# EAGLE design ssx32 (EAGLE 7.5.0)
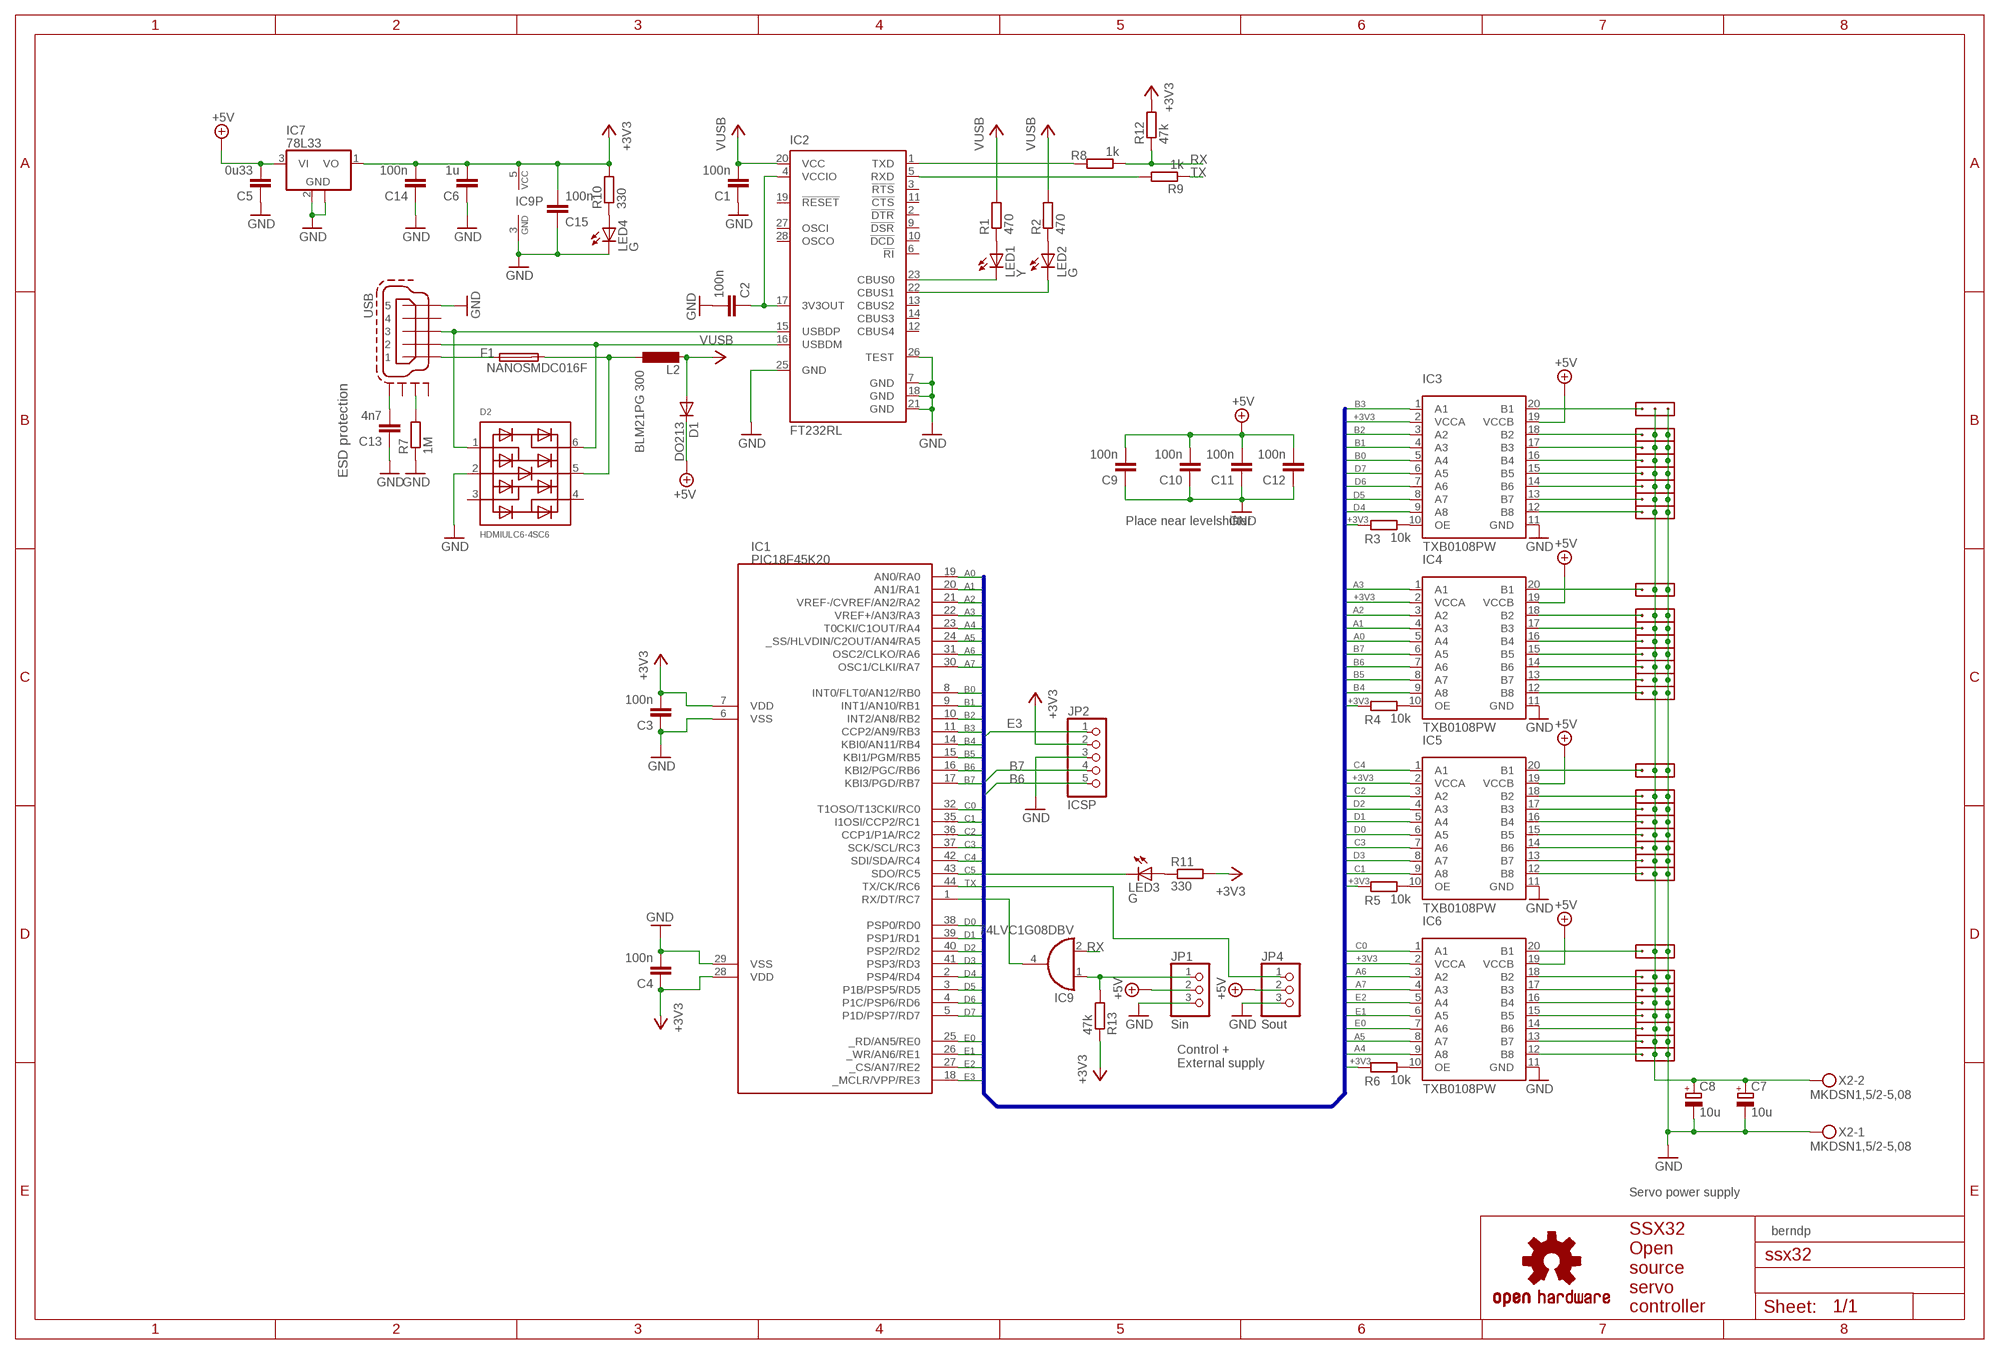
[diagram p0: schematic, sheet 1]

## Parts
C1  100n  C-EUC0603  [C0603]
C2  100n  C-EUC0603  [C0603]
C3  100n  C-EUC0603  [C0603]
C4  100n  C-EUC0603  [C0603]
C5  0u33  C-EUC0805  [C0805]
C6  1u  C-EUC0603  [C0603]
C7  10u  CPOL-EU153CLV-0505  [153CLV-0505]
C8  10u  CPOL-EU153CLV-0505  [153CLV-0505]
C9  100n  C-EUC0603  [C0603]
C10  100n  C-EUC0603  [C0603]
C11  100n  C-EUC0603  [C0603]
C12  100n  C-EUC0603  [C0603]
C13  4n7  C-EUC0603  [C0603]
C14  100n  C-EUC0603  [C0603]
C15  100n  C-EUC0603  [C0603]
D1  DO213  DIODE-MINIMELF  [MINIMELF]
D2  HDMIULC6-4SC6  [SOT23-5]
F1  NANOSMDC016F  [NANOSMDC016F]
IC1  PIC18F45K20  PIC18FXX20_PIC18LF4520-E/PT  [PIC18FXX20_TQFP44]
IC2  FT232RL  [SSOP28]
IC3  TXB0108PW  [PW_R-PDSO-G20]
IC4  TXB0108PW  [PW_R-PDSO-G20]
IC5  TXB0108PW  [PW_R-PDSO-G20]
IC6  TXB0108PW  [PW_R-PDSO-G20]
IC7  78L33  78L05F  [SOT89]
IC9  74LVC1G08DBV  [SOT23-5]
JP1  Sin  PINHD-1X3  [1X03]
JP2  ICSP  PINHD-1X5  [1X05]
JP4  Sout  PINHD-1X3  [1X03]
L2  BLM21PG 300  L-EU0805  [R0805]
LED1  Y  LEDCHIPLED_0603  [CHIPLED_0603]
LED2  G  LEDCHIPLED_0603  [CHIPLED_0603]
LED3  G  LEDCHIPLED_0603  [CHIPLED_0603]
LED4  G  LEDCHIPLED_0603  [CHIPLED_0603]
R1  470  R-EU_R0603  [R0603]
R2  470  R-EU_R0603  [R0603]
R3  10k  R-EU_R0603  [R0603]
R4  10k  R-EU_R0603  [R0603]
R5  10k  R-EU_R0603  [R0603]
R6  10k  R-EU_R0603  [R0603]
R7  1M  R-EU_R0603  [R0603]
R8  1k  R-EU_R0603  [R0603]
R9  1k  R-EU_R0603  [R0603]
R10  330  R-EU_R0603  [R0603]
R11  330  R-EU_R0603  [R0603]
R12  47k  R-EU_R0603  [R0603]
R13  47k  R-EU_R0603  [R0603]
U$2  OSHW-LOGOM  [OSHW-LOGO-M]
X1  8  PIN-1X3SM  [1X3]
X2  MKDSN1,5/2-5,08  [MKDSN1,5/2-5,08]
X3  17  PIN-1X3SM  [1X3]
X4  7  PIN-1X3SM  [1X3]
X5  6  PIN-1X3SM  [1X3]
X6  5  PIN-1X3SM  [1X3]
X7  4  PIN-1X3SM  [1X3]
X8  3  PIN-1X3SM  [1X3]
X9  2  PIN-1X3SM  [1X3]
X10  1  PIN-1X3SM  [1X3]
X11  19  PIN-1X3SM  [1X3]
X12  16  PIN-1X3SM  [1X3]
X13  15  PIN-1X3SM  [1X3]
X14  14  PIN-1X3SM  [1X3]
X15  13  PIN-1X3SM  [1X3]
X16  12  PIN-1X3SM  [1X3]
X17  11  PIN-1X3SM  [1X3]
X18  10  PIN-1X3SM  [1X3]
X19  9  PIN-1X3SM  [1X3]
X20  20  PIN-1X3SM  [1X3]
X21  21  PIN-1X3SM  [1X3]
X22  22  PIN-1X3SM  [1X3]
X23  23  PIN-1X3SM  [1X3]
X24  24  PIN-1X3SM  [1X3]
X25  25  PIN-1X3SM  [1X3]
X26  26  PIN-1X3SM  [1X3]
X27  27  PIN-1X3SM  [1X3]
X28  28  PIN-1X3SM  [1X3]
X29  29  PIN-1X3SM  [1X3]
X30  30  PIN-1X3SM  [1X3]
X31  31  PIN-1X3SM  [1X3]
X32  32  PIN-1X3SM  [1X3]
X34  18  PIN-1X3SM  [1X3]
X35  USB  MINI-USB-SCHIELD-32005-301  [32005-301]

## Nets
+3V3: C3.2 C4.1 C6.2 C14.2 C15.2 IC1.7(VDD) IC1.28(VDD) IC3.2(VCCA) IC4.2(VCCA) IC5.2(VCCA) IC6.2(VCCA) IC7.1(VO) IC9.5(VCC) JP2.2 R3.1 R4.1 R5.1 R6.1 R10.2 R11.2 R12.2 R13.1
+5V: C1.2 D1.A IC2.20(VCC) L2.2 R1.2 R2.2 ; supply symbol labelled VUSB
+UB: C5.2 C9.2 C10.2 C11.2 C12.2 D1.C IC3.19(VCCB) IC4.19(VCCB) IC5.19(VCCB) IC6.19(VCCB) IC7.3(VI) JP1.2 JP4.2 ; supply symbol labelled +5V
A0: IC1.19(AN0/RA0) IC4.5(A4)
A1: IC1.20(AN1/RA1) IC4.4(A3)
A2: IC1.21(VREF-/CVREF/AN2/RA2) IC4.3(A2)
A3: IC1.22(VREF+/AN3/RA3) IC4.1(A1)
A4: IC1.23(T0CKI/C1OUT/RA4) IC6.9(A8)
A5: IC1.24(_SS/HLVDIN/C2OUT/AN4/RA5) IC6.8(A7)
A6: IC1.31(OSC2/CLKO/RA6) IC6.3(A2)
A7: IC1.30(OSC1/CLKI/RA7) IC6.4(A3)
B0: IC1.8(INT0/FLT0/AN12/RB0) IC3.5(A4)
B1: IC1.9(INT1/AN10/RB1) IC3.4(A3)
B2: IC1.10(INT2/AN8/RB2) IC3.3(A2)
B3: IC1.11(CCP2/AN9/RB3) IC3.1(A1)
B4: IC1.14(KBI0/AN11/RB4) IC4.9(A8)
B5: IC1.15(KBI1/PGM/RB5) IC4.8(A7)
B6: IC1.16(KBI2/PGC/RB6) IC4.7(A6) JP2.5
B7: IC1.17(KBI3/PGD/RB7) IC4.6(A5) JP2.4
C0: IC1.32(T1OSO/T13CKI/RC0) IC6.1(A1)
C1: IC1.35(I1OSI/CCP2/RC1) IC5.9(A8)
C2: IC1.36(CCP1/P1A/RC2) IC5.8(A7)
C3: IC1.37(SCK/SCL/RC3) IC5.7(A6)
C4: IC1.42(SDI/SDA/RC4) IC5.1(A1)
C5: IC1.43(SDO/RC5) LED3.C
D0: IC1.38(PSP0/RD0) IC5.6(A5)
D1: IC1.39(PSP1/RD1) IC5.5(A4)
D2: IC1.40(PSP2/RD2) IC5.4(A3)
D3: IC1.41(PSP3/RD3) IC5.3(A2)
D4: IC1.2(PSP4/RD4) IC3.9(A8)
D5: IC1.3(P1B/PSP5/RD5) IC3.8(A7)
D6: IC1.4(P1C/PSP6/RD6) IC3.7(A6)
D7: IC1.5(P1D/PSP7/RD7) IC3.6(A5)
E0: IC1.25(_RD/AN5/RE0) IC6.7(A6)
E1: IC1.26(_WR/AN6/RE1) IC6.6(A5)
E2: IC1.27(_CS/AN7/RE2) IC6.5(A4)
E3: IC1.18(_MCLR/VPP/RE3) JP2.1
GND: C1.1 C2.2 C3.1 C4.2 C5.1 C6.1 C7.- C8.- C9.1 C10.1 C11.1 C12.1 C13.1 C14.1 C15.1 D2.2 IC1.6(VSS) IC1.29(VSS) IC2.7(GND) IC2.18(GND) IC2.21(GND) IC2.25(GND) IC2.26(TEST) IC3.11(GND) IC4.11(GND) IC5.11(GND) IC6.11(GND) IC7.2(GND) IC7.2@1(GND) IC9.3(GND) JP1.3 JP2.3 JP4.3 LED4.C R7.1 X1.P$3 X2.1 X3.P$3 X4.P$3 X5.P$3 X6.P$3 X7.P$3 X8.P$3 X9.P$3 X10.P$3 X11.P$3 X12.P$3 X13.P$3 X14.P$3 X15.P$3 X16.P$3 X17.P$3 X18.P$3 X19.P$3 X20.P$3 X21.P$3 X22.P$3 X23.P$3 X24.P$3 X25.P$3 X26.P$3 X27.P$3 X28.P$3 X29.P$3 X30.P$3 X31.P$3 X32.P$3 X34.P$3 X35.5
N$1: D2.6 IC2.16(USBDM) X35.2
N$2: F1.1 X35.1
N$3: IC2.23(CBUS0) LED1.C
N$4: IC2.22(CBUS1) LED2.C
N$5: LED1.A R1.1
N$6: LED2.A R2.1
N$8: IC3.20(B1) X1.P$1
N$9: IC3.10(OE) R3.2
N$10: IC4.10(OE) R4.2
N$11: IC5.10(OE) R5.2
N$12: IC6.10(OE) R6.2
N$13: IC4.18(B2) X13.P$1
N$14: IC3.18(B2) X4.P$1
N$15: IC3.17(B3) X5.P$1
N$16: IC3.16(B4) X6.P$1
N$17: IC3.15(B5) X7.P$1
N$18: IC3.14(B6) X8.P$1
N$19: IC3.13(B7) X9.P$1
N$20: IC3.12(B8) X10.P$1
N$21: IC5.17(B3) X11.P$1
N$22: IC4.17(B3) X14.P$1
N$23: IC4.16(B4) X15.P$1
N$24: IC4.15(B5) X16.P$1
N$25: IC4.14(B6) X17.P$1
N$26: IC4.13(B7) X18.P$1
N$27: IC4.12(B8) X19.P$1
N$28: IC5.16(B4) X20.P$1
N$29: IC5.15(B5) X21.P$1
N$30: IC5.14(B6) X22.P$1
N$31: IC5.13(B7) X23.P$1
N$32: IC5.12(B8) X24.P$1
N$33: IC5.20(B1) X3.P$1
N$34: IC4.20(B1) X12.P$1
N$35: IC6.16(B4) X28.P$1
N$36: IC6.15(B5) X29.P$1
N$37: IC6.14(B6) X30.P$1
N$38: IC6.13(B7) X31.P$1
N$39: IC6.12(B8) X32.P$1
N$40: IC6.18(B2) X26.P$1
N$41: IC6.17(B3) X27.P$1
N$43: IC6.20(B1) X25.P$1
N$44: IC5.18(B2) X34.P$1
N$45: LED3.A R11.1
N$47: D2.1 IC2.15(USBDP) X35.3
N$48: IC1.1(RX/DT/RC7) IC9.4(O)
N$49: R7.2 X35.M2(S:S2)
N$50: C13.2 X35.M4(S:S4)
N$51: D2.5 F1.2 L2.1
N$52: IC2.5(RXD) R9.2
N$53: IC2.1(TXD) R8.2
N$54: IC9.1(I0) JP1.1 R13.2
N$55: LED4.A R10.1
RX: IC9.2(I1) R8.1 R12.1
TX: IC1.44(TX/CK/RC6) JP4.1 R9.1
VPORT: C2.1 IC2.4(VCCIO) IC2.17(3V3OUT)
VSERVO: C7.+ C8.+ X1.P$2 X2.2 X3.P$2 X4.P$2 X5.P$2 X6.P$2 X7.P$2 X8.P$2 X9.P$2 X10.P$2 X11.P$2 X12.P$2 X13.P$2 X14.P$2 X15.P$2 X16.P$2 X17.P$2 X18.P$2 X19.P$2 X20.P$2 X21.P$2 X22.P$2 X23.P$2 X24.P$2 X25.P$2 X26.P$2 X27.P$2 X28.P$2 X29.P$2 X30.P$2 X31.P$2 X32.P$2 X34.P$2
Unconnected: D2.3 D2.4 IC2.2(!DTR) IC2.3(!RTS) IC2.6(!RI) IC2.9(!DSR) IC2.10(!DCD) IC2.11(!CTS) IC2.12(CBUS4) IC2.13(CBUS2) IC2.14(CBUS3) IC2.19(!RESET) IC2.27(OSCI) IC2.28(OSCO) X35.4 X35.M1(S:S1) X35.M3(S:S3)

## Buses
A[0..7],B[0..7],C[0..7],D[0..7],E[0..3],+3V3

## Notes on the sheet
- ESD protection
- Place near levelshifter
- Control +
  External supply
- Servo power supply
- berndp
- SSX32
  Open 
  source
  servo 
  controller

## Library data of the parts
C1-C6 C9-C15 = rcl:C-EU: CAPACITOR, European symbol
C7 C8 = rcl:CPOL-EU: POLARIZED CAPACITOR, European symbol
D1 = diode:DIODE-: DIODE
D2 = diode:HDMIULC6-4SC6: Mouser Part No: 511-HDMIULC6-4SC6
F1 = fuse:NANOSMDC016F
IC1 = 080_v025:PIC18FXX20_PIC18*4520: PIC18*4520 Microchip FLASH Microcontroller with A/D DEVICE FEATURES Feature PIC18*4520 Program Memory (bytes) 32768 Program Memory (instructions) 16384 Interupt Sources 20 I/O Ports Ports A, B, C, D, E Capture/Compare/PWM Modules 1 Enhanced Capture/Compare/PWM Modules 1 Parallel Communications (PSP) Yes 10-bit Analog-to-Digital Module 13 input Channels Package Types 40-pin PDIP 44-pin TQFP 44-pin QFN NOTES: F only after 18, means standard voltage range from 4.2v to 5.5v LF after 18, means extended voltage range from 2.0v to 5.5v -E before / denotes extended temperature range from -40°C to +120°C -I before / denotes industrial temperature range from -40°C to +85°C /PT suffix denotes TQFP package /SO suffix denotes SOIC package /SP suffix denotes Skinny Plastic DIP package /P suffix denotes Plastic DIP package /ML suffix denotes QFN package
IC2 = ftdichip:FT232R: Source: http://www.ftdichip.com/Documents/DataSheets/DS_FT232R_v104.pdf; MPN: FT232RL; OC_FARNELL: 1146032; OC_NEWARK: 91K9918
IC3-IC6 = texas:TXB0108PW
IC7 = linear:78L*: POSITOIV-VOLTAGE REGULATORS Output up to 100 mA Source: http://focus.ti.com/lit/ds/symlink/ua78l05.pdf
IC9 = 74xx-little-de:74*1G08: 2-input AND gate
JP1 JP4 = pinhead:PINHD-1X3: PIN HEADER
JP2 = pinhead:PINHD-1X5: PIN HEADER
L2 = rcl:L-EU: INDUCTOR, European symbol
LED1-LED4 = led:LED: LED OSRAM: - CHIPLED LG R971, LG N971, LY N971, LG Q971, LY Q971, LO R971, LY R971 LH N974, LH R974 LS Q976, LO Q976, LY Q976 LO Q996 - Hyper CHIPLED LW Q18S LB Q993, LB Q99A, LB R99A - SideLED LS A670, LO A670, LY A670, LG A670, LP A670 LB A673, LV A673, LT A673, LW A673 LH A674 LY A675 LS A676, LA A676, LO A676, LY A676, LW A676 LS A679, LY A679, LG A679 - Hyper Micro SIDELED® LS Y876, LA Y876, LO Y876, LY Y876 LT Y87S - SmartLED LW L88C, LW L88S LB L89C, LB L89S, LG L890 LS L89K, LO L89K, LY L89K LS L896, LA L896, LO L896, LY L896 - TOPLED LS T670, LO T670, LY T670, LG T670, LP T670 LSG T670, LSP T670, LSY T670, LOP T670, LYG T670 LG T671, LOG T671, LSG T671 LB T673, LV T673, LT T673, LW T673 LH T674 LS T676, LA T676, LO T676, LY T676, LB T676, LH T676, LSB T676, LW T676 LB T67C, LV T67C, LT T67C, LS T67K, LO T67K, LY T67K, LW E67C LS E67B, LA E67B, LO E67B, LY E67B, LB E67C, LV E67C, LT E67C LW T67C LS T679, LY T679, LG T679 LS T770, LO T770, LY T770, LG T770, LP T770 LB T773, LV T773, LT T773, LW T773 LH T774 LS E675, LA E675, LY E675, LS T675 LS T776, LA T776, LO T776, LY T776, LB T776 LHGB T686 LT T68C, LB T68C - Hyper Mini TOPLED® LB M676 - Mini TOPLED Santana® LG M470 LS M47K, LO M47K, LY M47K Source: http://www.osram.convergy.de LUXEON: - LUMILED® LXK2-PW12-R00, LXK2-PW12-S00, LXK2-PW14-U00, LXK2-PW14-V00 LXK2-PM12-R00, LXK2-PM12-S00, LXK2-PM14-U00 LXK2-PE12-Q00, LXK2-PE12-R00, LXK2-PE12-S00, LXK2-PE14-T00, LXK2-PE14-U00 LXK2-PB12-K00, LXK2-PB12-L00, LXK2-PB12-M00, LXK2-PB14-N00, LXK2-PB14-P00, LXK2-PB14-Q00 LXK2-PR12-L00, LXK2-PR12-M00, LXK2-PR14-Q00, LXK2-PR14-R00 LXK2-PD12-Q00, LXK2-PD12-R00, LXK2-PD12-S00 LXK2-PH12-R00, LXK2-PH12-S00 LXK2-PL12-P00, LXK2-PL12-Q00, LXK2-PL12-R00 Source: www.luxeon.com KINGBRIGHT: KA-3528ASYC Source: www.kingbright.com
R1-R13 = rcl:R-EU_: RESISTOR, European symbol
U$2 = SparkFun:OSHW-LOGO: Open Source Hardware Logo This logo indicates the piece of hardware it is found on incorporates a OSHW license and/or adheres to the definition of open source hardware found here: http://freedomdefined.org/OSHW
X1 X3-X32 X34 = pinhead:PIN-1X3SM
X2 = con-phoenix-508:MKDSN1,5/2-5,08: MKDSN 1,5/ 2-5,08 Printklemme Nennstrom: 13,5 A Nennspannung: 250 V Rastermaß: 5,08 mm Polzahl: 2 Anschlussart: Schraubanschluss Montage: Löten Anschlussrichtung Leiter/Platine: 0 ° Artikelnummer: 1729128 Source: http://eshop.phoenixcontact.com .. 1729128.pdf
X35 = con-cypressindustries:MINI-USB-SCHIELD-: MINI USB-B Conector Source: www.cypressindustries.com; OC_FARNELL: unknown; OC_NEWARK: unknown

## Board
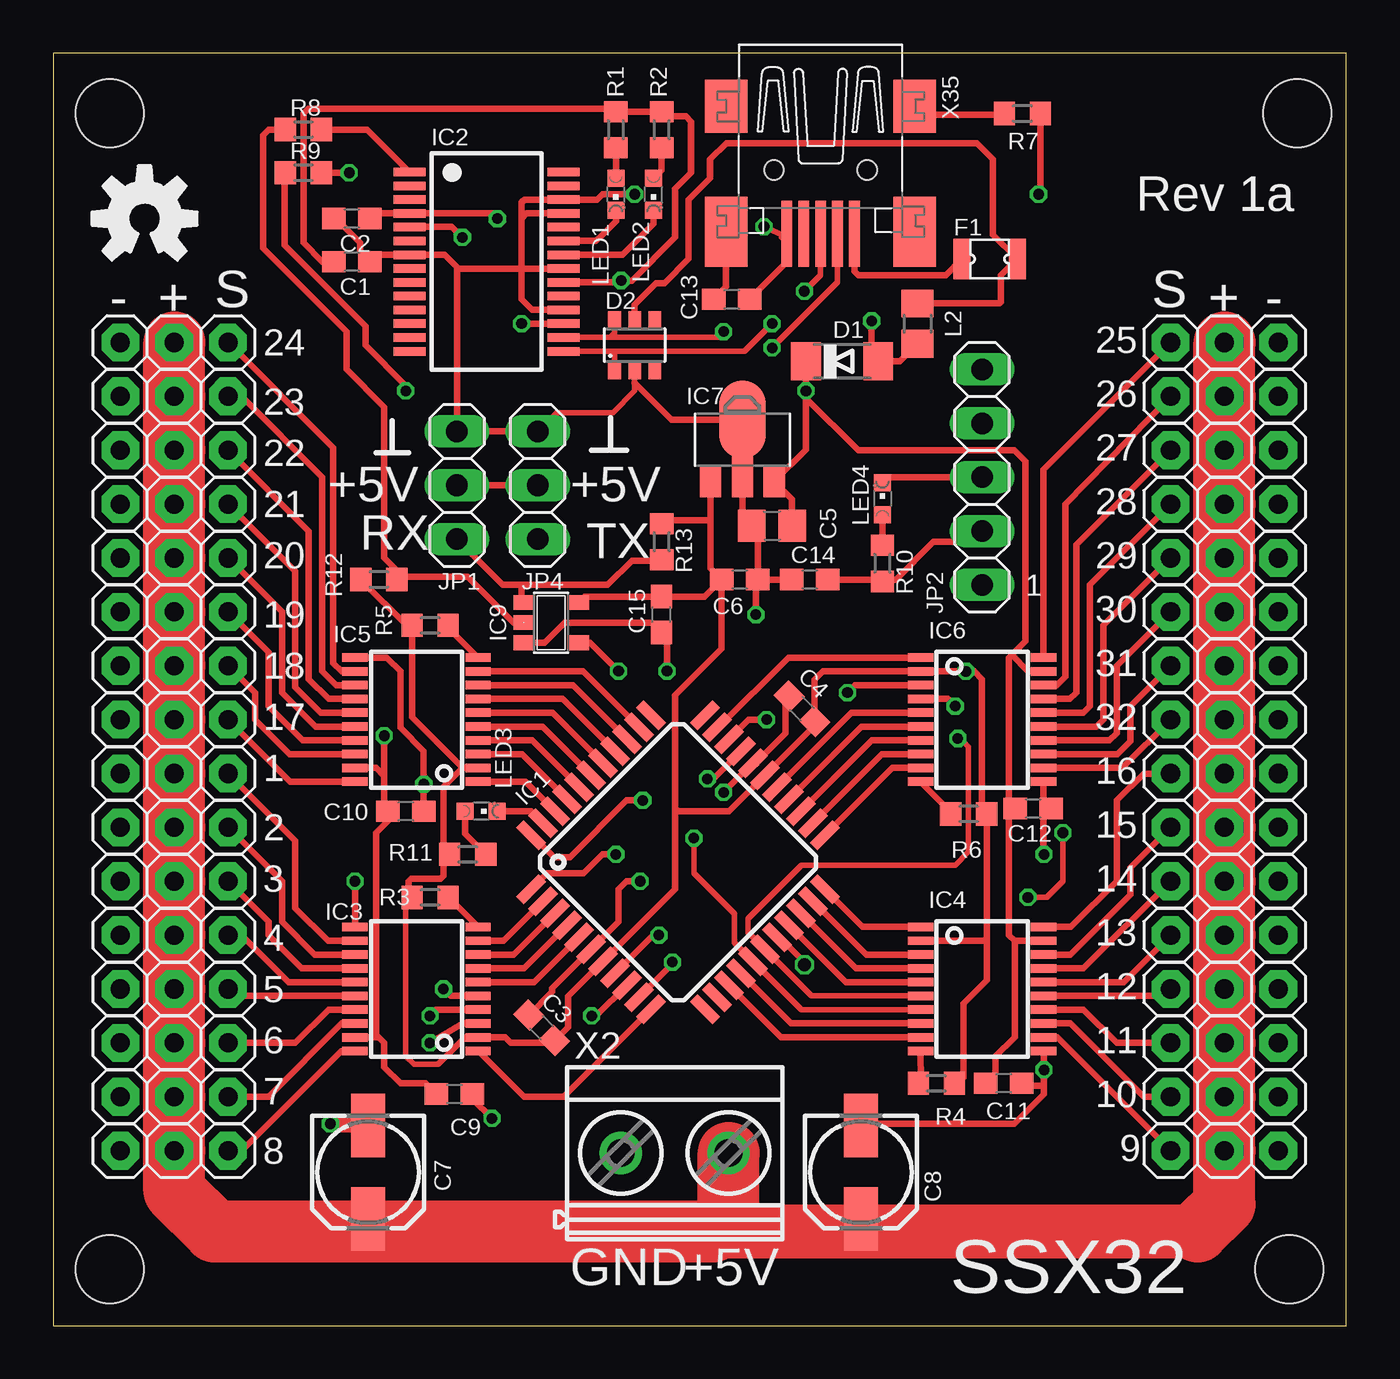
[diagram p1: board, top side]
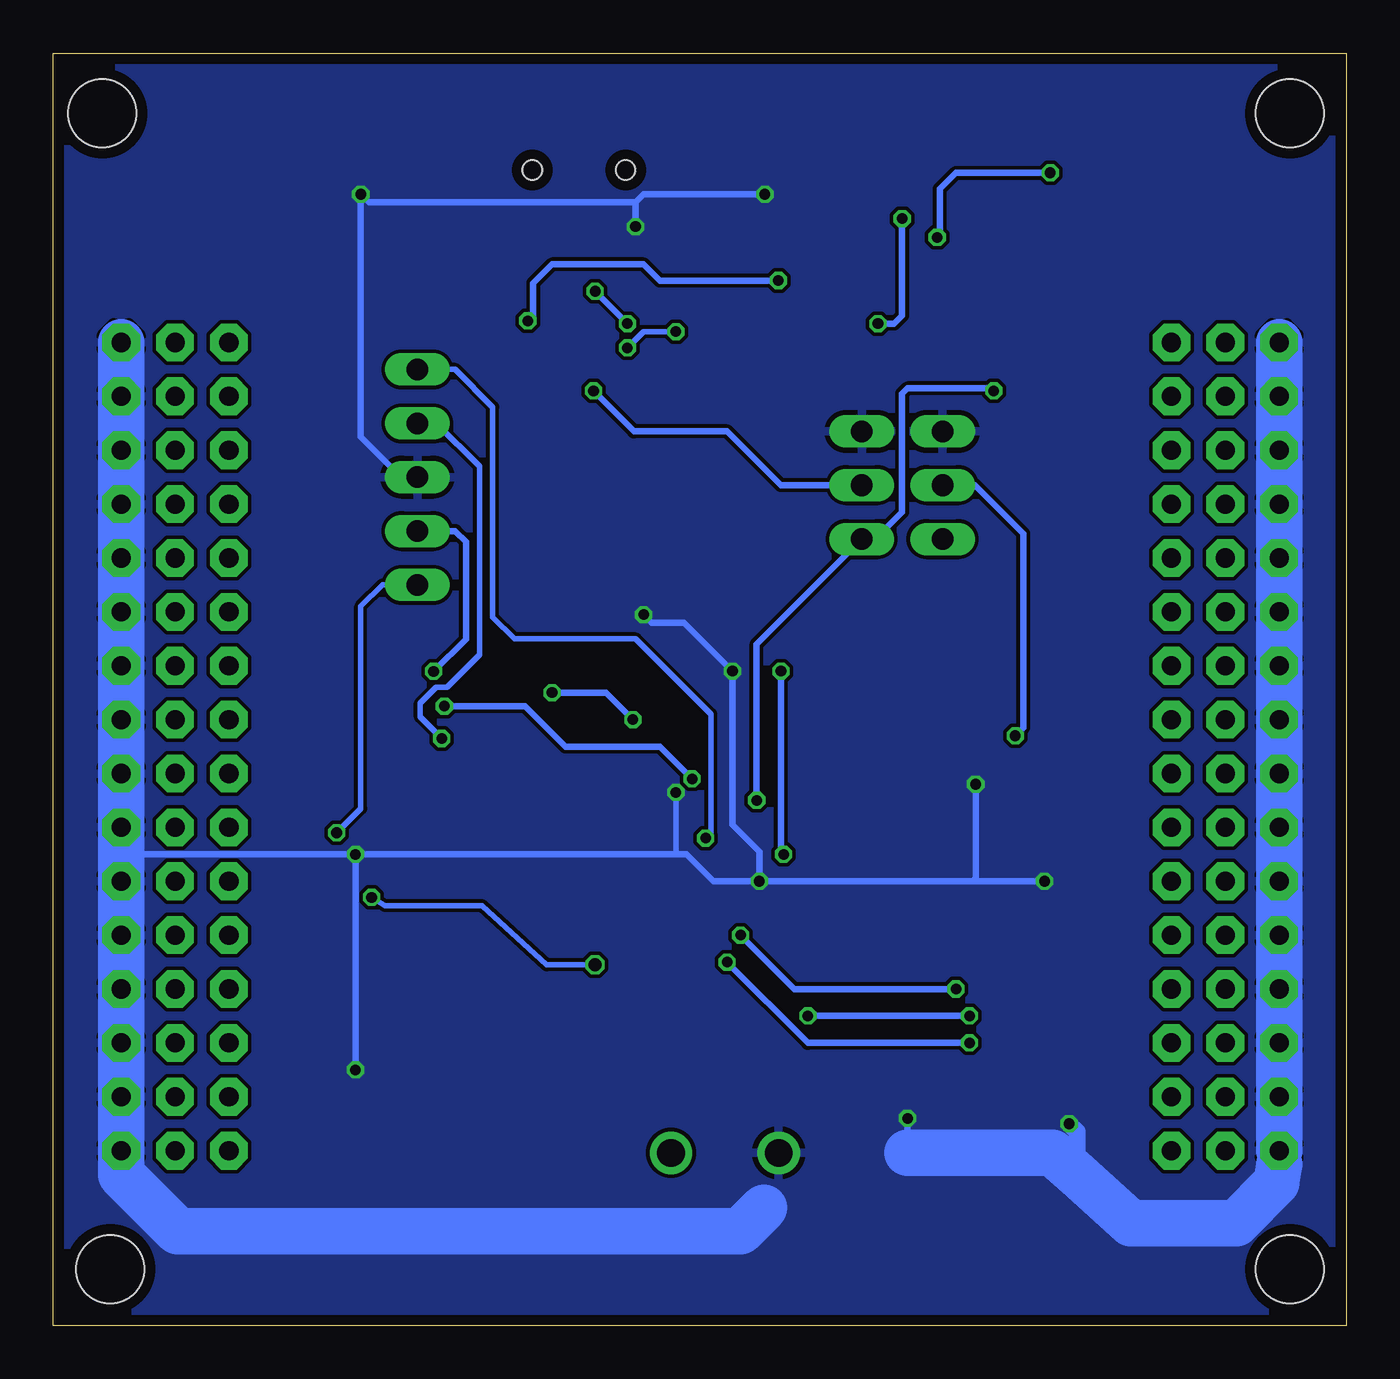
[diagram p2: board, bottom side, seen from below]

Size 61 x 60 mm. Coordinates in mm from the lower left corner, seen from the top.
Outline: 0,0 61,0 61,60 0,60 0,0
Copper layers (1*16): Top 0.035mm / dielectric 1.5mm / Bottom 0.035mm
Design rules "smartPrototyping": minimum track width 7mil, minimum drill 12mil, track to track 7mil, track to pad 7mil, pad to pad 7mil, via to via 7mil, smd to smd 0mil, copper to edge 20mil, drill to drill 10mil, minimum pad ring 10mil, minimum via ring 6mil, stop-mask expansion 2mil, vias tented up to drill 25mil, thermal gap 10mil
Holes 3.2 mm at 2.67,57.15 58.67,57.15 58.29,2.67 2.67,2.67

### Footprints (pad centres in the part's own frame; a part is rotated, then mirrored left to right if it is on the bottom)
C0603 = smd 1.1 x 1: 1 -0.85,0; 2 0.85,0
C0805 = smd 1.3 x 1.5: 1 -0.95,0; 2 0.95,0
153CLV-0505 = smd 3 x 1.6: + 2.2,0; - -2.2,0
MINIMELF = smd 1.4 x 1.8: A 1.7,0; C -1.7,0
SOT23-5 = smd 0.6 x 0.9: 1 -0.95,-1.15; 2 0,-1.15; 3 0.95,-1.15; 4 0.95,1.15; 5 0,1.15; 6 -0.95,1.15
NANOSMDC016F = smd 0.8 x 1.9: 1 -1.2,0; 2 1.4,0
PIC18FXX20_TQFP44 = smd 1.5 x 0.5: 1 -5.8,4; 2 -5.8,3.2; 3 -5.8,2.4; 4 -5.8,1.6; 5 -5.8,0.8; 6 -5.8,0; 7 -5.8,-0.8; 8 -5.8,-1.6; 9 -5.8,-2.4; 10 -5.8,-3.2; 11 -5.8,-4; 23 5.8,-4; 24 5.8,-3.2; 25 5.8,-2.4; 26 5.8,-1.6; 27 5.8,-0.8; 28 5.8,0; 29 5.8,0.8; 30 5.8,1.6; 31 5.8,2.4; 32 5.8,3.2; 33 5.8,4 | smd 0.5 x 1.5: 12 -4,-5.8; 13 -3.2,-5.8; 14 -2.4,-5.8; 15 -1.6,-5.8; 16 -0.8,-5.8; 17 0,-5.8; 18 0.8,-5.8; 19 1.6,-5.8; 20 2.4,-5.8; 21 3.2,-5.8; 22 4,-5.8; 34 4,5.8; 35 3.2,5.8; 36 2.4,5.8; 37 1.6,5.8; 38 0.8,5.8; 39 0,5.8; 40 -0.8,5.8; 41 -1.6,5.8; 42 -2.4,5.8; 43 -3.2,5.8; 44 -4,5.8
SSOP28 = smd 0.4 x 1.5: 1 -4.225,-3.625; 2 -3.575,-3.625; 3 -2.925,-3.625; 4 -2.275,-3.625; 5 -1.625,-3.625; 6 -0.975,-3.625; 7 -0.325,-3.625; 8 0.325,-3.625; 9 0.975,-3.625; 10 1.625,-3.625; 11 2.275,-3.625; 12 2.925,-3.625; 13 3.575,-3.625; 14 4.225,-3.625; 15 4.225,3.625; 16 3.575,3.625; 17 2.925,3.625; 18 2.275,3.625; 19 1.625,3.625; 20 0.975,3.625; 21 0.325,3.625; 22 -0.325,3.625; 23 -0.975,3.625; 24 -1.625,3.625; 25 -2.275,3.625; 26 -2.925,3.625; 27 -3.575,3.625; 28 -4.225,3.625
PW_R-PDSO-G20 = smd 0.4 x 1.2: 1 -2.925,-2.9; 2 -2.275,-2.9; 3 -1.625,-2.9; 4 -0.975,-2.9; 5 -0.325,-2.9; 6 0.325,-2.9; 7 0.975,-2.9; 8 1.625,-2.9; 9 2.275,-2.9; 10 2.925,-2.9; 11 2.925,2.9; 12 2.275,2.9; 13 1.625,2.9; 14 0.975,2.9; 15 0.325,2.9; 16 -0.325,2.9; 17 -0.975,2.9; 18 -1.625,2.9; 19 -2.275,2.9; 20 -2.925,2.9
SOT89 = smd 1 x 1.5: 1 -1.499,-1.981; 3 1.499,-1.981 | smd 1 x 2: 2 0,-1.727 | smd 2.2 x 3.7: 2@1 0,0.94
SOT23-5' = smd 0.69 x 0.99: 1 -0.95,-1.29; 2 0,-1.29; 3 0.95,-1.29; 4 0.95,1.3; 5 -0.95,1.3
1X03 = drill 1.016 long: 1 -2.54,0; 2 0,0; 3 2.54,0
1X05 = drill 1.016 long: 1 -5.08,0; 2 -2.54,0; 3 0,0; 4 2.54,0; 5 5.08,0
R0805 = smd 1.3 x 1.5: 1 -0.95,0; 2 0.95,0
CHIPLED_0603 = smd 0.8 x 0.8: A 0,-0.75; C 0,0.75
R0603 = smd 1 x 1.1: 1 -0.85,0; 2 0.85,0
1X3 = drill 0.9 pad 1.778 octagon: P$1 -2.54,0; P$2 0,0; P$3 2.54,0
MKDSN1,5/2-5,08 = drill 1.3 pad 2: 1 -2.561,0.025; 2 2.519,0.025
32005-301 = smd 3.1 x 0.5: 1 3,1.6; 2 3,0.8; 3 3,0; 4 3,-0.8; 5 3,-1.6 | smd 2.5 x 2: M1 -3,-4.45; M2 -3,4.45 | smd 3.3 x 2: M3 2.9,4.45; M4 2.9,-4.45 | hole 0.9: 0,2.2; 0,-2.2

### Placement (x,y rotation side)
C1  14.1,50.16 180 top
C2  14.1,52.2 180 top
C3  23.05,14.05 315 top
C4  35.32,29.08 135 top
C5  33.91,37.72 0 top
C6  32.38,35.18 180 top
C7  14.86,7.24 270 top
C8  38.1,7.24 270 top
C9  18.92,10.92 180 top
C10  16.64,24.26 180 top
C11  44.83,11.43 180 top
C12  46.23,24.38 180 top
C13  32,48.39 180 top
C14  35.69,35.18 0 top
C15  28.7,33.53 90 top
D1  37.21,45.47 0 top
D2  27.43,46.23 0 top
F1  44.07,50.29 0 top
IC1  29.47,21.85 45 top
IC2  20.45,50.16 270 top
IC3  17.14,15.88 90 top
IC4  43.81,15.88 270 top
IC5  17.14,28.57 90 top
IC6  43.81,28.57 270 top
IC7  32.51,41.78 0 top
IC9  74LVC1G08DBV  [SOT23-5']  23.5,33.15 270 top
JP1  19.05,39.62 90 top
JP2  43.81,40.01 90 top
JP4  22.86,39.62 90 top
L2  40.77,47.24 270 top
LED1  26.54,53.34 180 top
LED2  28.32,53.34 180 top
LED3  20.19,24.26 270 top
LED4  39.12,38.99 0 top
R1  26.54,56.39 90 top
R2  28.7,56.39 90 top
R3  17.78,20.19 0 top
R4  41.66,11.43 180 top
R5  17.78,33.02 0 top
R6  43.18,24.13 180 top
R7  45.72,57.15 180 top
R8  11.81,56.39 0 top
R9  11.81,54.36 0 top
R10  39.12,35.94 270 top
R11  19.56,22.23 180 top
R12  15.37,35.18 180 top
R13  28.7,36.96 270 top
U$2  4.32,52.2 0 top
X1  5.71,8.26 180 top
X2  29.34,8.13 0 top
X3  5.71,28.57 180 top
X4  5.71,10.79 180 top
X5  5.71,13.34 180 top
X6  5.71,15.88 180 top
X7  5.71,18.41 180 top
X8  5.71,20.95 180 top
X9  5.71,23.5 180 top
X10  5.71,26.04 180 top
X11  5.71,33.66 180 top
X12  55.24,26.04 0 top
X13  55.24,23.5 0 top
X14  55.24,20.95 0 top
X15  55.24,18.41 0 top
X16  55.24,15.88 0 top
X17  55.24,13.34 0 top
X18  55.24,10.79 0 top
X19  55.24,8.26 0 top
X20  5.71,36.2 180 top
X21  5.71,38.73 180 top
X22  5.71,41.27 180 top
X23  5.71,43.81 180 top
X24  5.71,46.35 180 top
X25  55.24,46.35 0 top
X26  55.24,43.81 0 top
X27  55.24,41.27 0 top
X28  55.24,38.73 0 top
X29  55.24,36.2 0 top
X30  55.24,33.66 0 top
X31  55.24,31.11 0 top
X32  55.24,28.57 0 top
X34  5.71,31.11 180 top
X35  36.2,54.48 270 top

### Tracks (layer width: path | path; a pad name or v marks a point on that pad's centre or on a via)
+3V3  (via drill 0.5)
  Top 0.254: R3.1 16.64,20.03 16.64,12.7 17.02,12.32 18.16,12.32 19.44,13.6 IC3.2
  Top 0.305: IC3.2 21.32,13.6 21.59,13.34 23.54,13.34 C3.2 24.28,14.08 24.28,15.53 IC1.7 29.34,20.57 29.34,24.38 | 16.93,20.61 R3.1 16.76,20.36 16.76,20.95 16.89,21.08 18.29,21.08 18.41,21.21 18.41,21.84 | 18.41,21.84 18.41,25.4 19.32,26.3 | 19.32,26.3 IC5.2 | 19.32,26.3 16.93,28.68 R5.1 16.68,33.02 R12.2 | R4.1 42.93,11.68 42.93,15.19 44.03,16.3 44.03,18.29 | 44.03,18.29 R6.1 43.81,24.34 43.81,30.48 43.45,30.85 v43.05,30.85 41.4,30.85 IC6.2 | 29.34,24.38 29.34,29.72 31.54,31.92 C6.2 | IC4.2 43.89,18.15 44.03,18.29 | 35.92,28.3 IC1.28 31.88,24.26 29.46,24.26 29.34,24.38 | C4.1 35.92,30.45 36.32,30.86 41.39,30.86 | JP2.2 43.31,36.96 41.53,36.96 39.75,35.18 39.12,35.18 R10.2 39.03,35.18 C14.2 | R11.2 18.71,22.14 18.41,21.84 | IC7.1 31.01,37.97 | 31.01,37.97 31.01,35.7 C6.2 | C6.2 30.73,34.38 C15.2 25.08,34.38 IC9.5 | R13.1 28.87,37.97 31.01,37.97
  Top 0.406: C4.1 35.92,28.3 | 41.39,30.86 41.4,30.85
  Bottom 0.305: JP2.2 42.04,37.47 41.53,36.96 41.53,32.37 v43.05,30.85
+5V  (via drill 0.5)
  Top 0.305: D1.A 38.58,46.14 | C1.2 12.7,50.16 11.81,51.05 11.81,57.15 12.03,57.37 26.42,57.37 R1.2 R2.2 28.92,57.02 29.84,57.02 30.1,56.77 30.1,54.36 29.34,53.59 29.34,51.31 27.3,49.28 v26.8,49.28 26.71,49.19 IC2.20 | D1.A 39.94,45.47 L2.2 | v38.61,47.37 38.61,45.77 D1.A
  Bottom 0.305: v26.8,49.28 32.38,49.28 33.15,50.04 37.47,50.04 38.35,49.15 38.35,47.62 v38.61,47.37
+UB  (via drill 0.5)
  Top 0.254: C12.2 45.25,24.51 45.09,24.51
  Top 0.305: IC6.19 45.98,30.85 45.21,31.62 | 45.35,18.15 IC4.19 | 45.35,18.15 45.09,18.41 45.09,24.51 45.09,31.5 45.21,31.62 | 15.24,13.72 15.24,13.6 15.36,13.6 15.62,13.34 15.62,12.19 16.38,11.43 17.57,11.43 C9.2 18.03,10.92 | 15.24,13.72 15.24,23.24 15.79,23.79 C10.2 15.62,24.04 15.62,25.91 | IC3.19 15.12,13.6 15.24,13.72 | JP1.2 JP4.2 | IC5.19 15.23,26.3 15.62,25.91 | 15.62,25.91 v15.62,27.81 | 45.35,18.15 45.35,13.6 44.45,12.7 44.45,11.9 C11.2 | D1.C v35.51,44.07 | 45.21,31.62 45.85,32.26 45.85,40.77 45.34,41.27 37.97,41.27 35.51,43.74 v35.51,44.07 | v35.51,44.07 35.51,41.3 IC7.3 34.86,38.95 C5.2
  Bottom 0.305: JP1.2 17.53,39.62 15.24,37.34 15.24,28.19 v15.62,27.81 | JP4.2 26.67,39.62 29.21,42.16 33.61,42.16 v35.51,44.07
A0
  Top 0.305: IC4.5 37.39,16.2 IC1.19
A1
  Top 0.305: IC4.4 37.87,16.85 IC1.20
A2
  Top 0.305: IC4.3 38.35,17.5 IC1.21
A3
  Top 0.305: IC4.1 38.18,18.8 IC1.22
A4
  Top 0.305: IC6.9 39.58,26.3 IC1.23
A5
  Top 0.305: IC6.8 39.1,26.95 IC1.24
A6  (via drill 0.5)
  Top 0.305: IC6.3 37.82,30.2 v37.47,29.84 | v33.66,28.57 32.8,28.57 IC1.31
  Bottom 0.305: v37.47,29.84 34.92,29.84 v33.66,28.57
A7  (via drill 0.5)
  Top 0.305: IC6.4 42.2,29.55 v42.55,29.21 | v30.86,25.78 31.14,25.78 IC1.30
  Bottom 0.305: v42.55,29.21 38.73,29.21 36.83,27.3 32.38,27.3 v30.86,25.78
B0  (via drill 0.5)
  Top 0.305: IC3.5 18.74,15.55 v18.41,15.88 | IC1.8 27.3,17.42 28.3,18.41 v28.57,18.41
  Bottom 0.305: v28.57,18.41 26.04,15.88 v18.41,15.88
B1  (via drill 0.5)
  Top 0.305: IC3.4 18.07,14.9 v17.78,14.61 | v25.4,14.61 25.62,14.61 IC1.9
  Bottom 0.305: v17.78,14.61 v25.4,14.61
B2  (via drill 0.5)
  Top 0.305: IC3.3 19.33,14.25 v17.78,13.34 | v29.21,17.14 29.21,17.06 IC1.10
  Bottom 0.305: v17.78,13.34 25.4,13.34 v29.21,17.14
B3
  Top 0.305: IC3.1 20.07,12.95 22.23,10.79 24.07,10.79 IC1.11
B4
  Top 0.305: IC4.9 34.33,13.6 IC1.14
B5
  Top 0.305: IC4.8 34.81,14.25 IC1.15
B6  (via drill 0.5)
  Top 0.254: IC4.7 35.29,14.9 IC1.16 32.13,18.06 32.13,19.43 30.23,21.34 v30.23,22.99
  Bottom 0.254: v30.23,22.99 29.97,23.24 29.97,28.83 33.53,32.38 39.24,32.38 40.26,33.4 40.26,43.31 42.04,45.09 JP2.5
B7  (via drill 0.5)
  Top 0.254: IC4.6 35.78,15.55 IC1.17 32.77,18.56 32.77,19.18 35.31,21.72 42.55,21.72 43.18,22.35 43.18,27.3 42.8,27.69 v42.67,27.69
  Bottom 0.254: v42.67,27.69 43.69,28.7 43.69,29.34 42.93,30.1 42.42,30.1 40.89,31.62 40.89,40.51 42.93,42.55 JP2.4
C0
  Top 0.305: IC1.32 31.39,28.22 34.67,31.5 IC6.1
C1
  Top 0.305: IC5.9 25,30.85 IC1.35
C2
  Top 0.305: IC5.8 24.52,30.2 IC1.36
C3
  Top 0.305: IC5.7 24.04,29.55 IC1.37
C4
  Top 0.305: IC5.1 22.28,25.65 IC1.42
C5
  Top 0.305: LED3.C 22.54,24.26 IC1.43
D0
  Top 0.305: IC5.6 23.56,28.9 IC1.38
D1
  Top 0.305: IC5.5 23.08,28.25 IC1.39
D2
  Top 0.305: IC5.4 22.59,27.6 IC1.40
D3
  Top 0.305: IC5.3 22.11,26.95 IC1.41
D4
  Top 0.305: IC3.9 21.24,18.15 IC1.2
D5
  Top 0.305: IC3.8 21.73,17.5 IC1.3
D6
  Top 0.305: IC3.7 22.21,16.85 IC1.4
D7
  Top 0.305: IC3.6 22.69,16.2 IC1.5
E0
  Top 0.305: IC6.7 38.61,27.6 IC1.25
E1
  Top 0.305: IC6.6 38.13,28.25 IC1.26
E2
  Top 0.305: IC6.5 37.65,28.9 IC1.27
E3  (via drill 0.5, 0.6)
  Top 0.254: IC1.18 34.26,18.32 35.31,17.27 35.31,17.14 v35.43,17.02 | v45.97,20.19 46.86,20.19 47.62,20.95 v47.62,23.24
  Bottom 0.254: JP2.1 45.47,34.92 46.48,33.91 46.48,24.38 v47.62,23.24 | v35.43,17.02 37.72,17.02 40.77,19.81 45.34,19.81 v45.97,20.19
GND  (via drill 0.5)
  Top 0.254: 46.72,24.38 C12.1 | D2.2 27.43,44.45 27.43,44.07 26.42,43.05 23.75,43.05 JP4.3 | IC1.29 33,26.52 v31.62,25.15
  Top 0.305: C3.1 23.54,15.74 23.54,15.92 IC1.6 26.67,19.05 26.67,20.57 27.05,20.95 v27.69,20.95 | IC6.11 46.72,24.38 46.72,22.59 v46.74,22.23 | IC4.11 46.74,12.59 v46.74,12.06 46.74,11.3 | v14.24,20.95 IC3.11 | 46.74,11.3 46.74,10.92 45.34,9.53 38.19,9.53 C8.- | C9.1 19.77,10.71 v20.7,9.78 | C2.2 13.25,52.28 14.48,51.05 14.48,50.63 C1.1 15.27,50.49 IC2.7 18.47,50.49 19.05,49.91 | v27.43,53.34 25.91,53.34 25.66,53.09 IC2.26 22.23,53.09 22.1,52.96 22.1,52.2 | v33.53,51.82 34.39,51.44 34.39,51.31 X35.5 34.59,50.13 C13.1 | 14.77,9.53 C7.- | IC5.11 15.74,31.5 16.38,30.86 16.38,28.19 17.49,27.09 v17.49,25.53 C10.1 17.57,24.18 | 19.05,49.91 JP1.3 JP4.3 | 22.1,49.84 19.12,49.84 19.05,49.91 | 22.1,49.84 IC2.21 | IC2.18 22.59,47.89 22.1,48.39 22.1,49.84 | 22.1,52.2 22.1,49.84 | IC2.25 22.34,52.44 22.1,52.2 | v33.15,33.53 33.15,35.09 C6.1 | R7.1 46.57,53.43 v46.48,53.34 | 46.74,11.3 45.81,11.3 C11.1 | 33.12,26.52 34.54,27.94 34.54,29.51 | C6.1 33.23,37.44 C5.1 32.51,38.17 IC7.2 IC7.2@1 29.16,42.72 27.43,44.45 | C14.1 C6.1 | JP2.3 39.38,40.01 LED4.C | v28.96,30.86 28.96,32.42 C15.1 28.23,33.15 24.13,33.15 23.18,32.2 IC9.3
  Top 0.406: IC1.29 33.12,26.52 | 34.54,29.51 C4.2
  Top 0.813: v13.08,9.53 14.77,9.53
  Bottom 0.254: X1.P$3 3.17,7.62 | v31.62,25.15 31.62,22.35 31.5,22.23
  Bottom 0.305: v46.74,22.23 v46.74,12.06 | v46.74,22.23 57.15,22.23 57.78,22.86 X13.P$3 | v27.69,20.95 17.65,20.95 | 17.65,20.95 v14.24,20.95 | v27.69,20.95 29.84,20.95 31.11,22.23 31.5,22.23 v46.74,22.23 | 20.7,8.15 v20.7,9.78 | 33.53,52.96 v33.53,51.82 | 33.53,52.96 33.15,53.34 v27.43,53.34 | JP2.3 44.2,39.62 46.48,41.91 v46.48,53.34 46.1,52.96 33.53,52.96 | v27.69,20.95 27.69,22.35 28.96,23.62 v28.96,30.86 31.24,33.15 32.77,33.15 v33.15,33.53 | v17.49,25.53 17.49,21.12 17.65,20.95
  Bottom 0.813: v13.08,9.53 12.7,9.15 12.7,7.11
  Bottom 2.184: X24.P$3 X23.P$3 X22.P$3 X21.P$3 X20.P$3 X11.P$3 X34.P$3 X3.P$3 X10.P$3 X9.P$3 X8.P$3 X7.P$3 X6.P$3 X5.P$3 X4.P$3 X1.P$3 | X25.P$3 X26.P$3 X27.P$3 X28.P$3 X29.P$3 X30.P$3 X31.P$3 X32.P$3 X12.P$3 X13.P$3 X14.P$3 X15.P$3 X16.P$3 X17.P$3 X18.P$3 X19.P$3 57.78,7.11 55.12,4.45 28.57,4.45 27.46,5.56 | 20.7,8.15 13.87,8.15 12.7,7.11 10.16,4.83 5.21,4.83 3.3,6.73 3.17,7.62
  pour Bottom: 0,60.07 60.96,60.07 60.96,-0.13 0,-0.13
N$1  (via drill 0.5)
  Top 0.254: IC2.16 26.29,46.59 | 26.29,46.59 31.35,46.59 v31.62,46.86 | v33.91,46.1 36.99,49.19 X35.2 | D2.6 26.48,46.78 26.29,46.59
  Bottom 0.254: v31.62,46.86 33.15,46.86 v33.91,46.1
N$2
  Top 0.305: X35.1 37.8,49.71 37.97,49.53 42.11,49.53 F1.1
N$3
  Top 0.305: LED1.C 26.54,52.07 26.29,51.82 25.91,51.44 25.61,51.14 IC2.23
N$4
  Top 0.305: LED2.C 28.32,51.94 26.87,50.49 IC2.22
N$5
  Top 0.305: R1.1 LED1.A
N$6
  Top 0.305: R2.1 28.7,54.47 LED2.A
N$8
  Top 0.305: IC3.20 13.59,12.95 8.89,8.26 X1.P$1
N$9
  Top 0.305: R3.2 18.63,20.21 IC3.10
N$10
  Top 0.305: R4.2 40.93,11.54 IC4.10
N$11
  Top 0.305: R5.2 18.63,32.91 IC5.10
N$12
  Top 0.305: R6.2 42.33,24.23 IC6.10
N$13
  Top 0.305: IC4.18 47.98,17.5 50.8,20.32 50.8,21.59 X13.P$1
N$14
  Top 0.305: IC3.18 13.62,14.25 10.16,10.79 X4.P$1
N$15
  Top 0.305: IC3.17 12.99,14.9 11.43,13.34 X5.P$1
N$16
  Top 0.305: IC3.16 8.58,15.55 X6.P$1
N$17
  Top 0.305: IC3.15 11.11,16.2 8.89,18.41 X7.P$1
N$18
  Top 0.305: IC3.14 11.72,16.85 10.16,18.41 10.16,19.05 X8.P$1
N$19
  Top 0.305: IC3.13 12.35,17.5 10.79,19.05 10.79,20.95 X9.P$1
N$20
  Top 0.305: IC3.12 12.96,18.15 11.43,19.68 11.43,22.86 X10.P$1
N$21
  Top 0.305: IC5.17 11.77,27.6 10.16,29.21 10.16,31.75 X11.P$1
N$22
  Top 0.305: IC4.17 48.6,16.85 X14.P$1
N$23
  Top 0.305: IC4.16 50.49,16.2 X15.P$1
N$24
  Top 0.305: IC4.15 52.38,15.55 X16.P$1
N$25
  Top 0.305: IC4.14 48.6,14.9 50.16,13.34 X17.P$1
N$26
  Top 0.305: IC4.13 47.98,14.25 51.44,10.79 X18.P$1
N$27
  Top 0.305: IC4.12 47.36,13.6 X19.P$1
N$28
  Top 0.305: IC5.16 12.39,28.25 10.79,29.84 10.79,33.66 X20.P$1
N$29
  Top 0.305: IC5.15 12.63,28.9 11.43,30.1 11.43,35.56 X21.P$1
N$30
  Top 0.305: IC5.14 12.99,29.55 12.06,30.48 12.06,37.47 X22.P$1
N$31
  Top 0.305: IC5.13 13.36,30.2 12.7,30.86 12.7,40.01 8.89,43.81 X23.P$1
N$32
  Top 0.305: IC5.12 13.6,30.85 13.21,31.24 13.21,41.4 X24.P$1
N$33
  Top 0.305: IC5.20 11.18,25.65 X3.P$1
N$34
  Top 0.305: IC4.20 48.01,18.8 50.16,20.95 50.16,24.77 51.44,26.04 X12.P$1
N$35
  Top 0.305: IC6.16 48.59,28.9 48.9,29.21 48.9,34.92 X28.P$1
N$36
  Top 0.305: IC6.15 49.2,28.25 49.53,28.57 49.53,33.02 X29.P$1
N$37
  Top 0.305: IC6.14 49.83,27.6 50.16,27.94 50.16,31.11 X30.P$1
N$38
  Top 0.305: IC6.13 50.19,26.95 50.8,27.56 50.8,29.21 X31.P$1
N$39
  Top 0.305: IC6.12 50.43,26.3 X32.P$1
N$40
  Top 0.305: IC6.18 47.34,30.2 47.75,30.61 47.75,38.73 X26.P$1
N$41
  Top 0.305: IC6.17 47.97,29.55 48.26,29.84 48.26,36.83 X27.P$1
N$43
  Top 0.305: IC6.20 46.72,40.37 X25.P$1
N$44
  Top 0.305: IC5.18 11.15,26.95 9.53,28.57 9.53,29.84 X34.P$1
N$45
  Top 0.305: LED3.A 19.44,23.19 R11.1
N$47  (via drill 0.5)
  Top 0.254: IC2.15 26.29,45.94 | 26.29,45.94 32.6,45.94 v33.91,47.24 | v35.43,48.77 36.2,49.53 X35.3 | D2.1 26.48,45.75 26.29,45.94
  Bottom 0.254: v33.91,47.24 v35.43,48.77
N$48  (via drill 0.5)
  Top 0.305: IC1.1 23.3,21.34 25.02,21.34 25.91,22.23 v26.54,22.23 | v26.67,30.86 25.33,32.2 IC9.4
  Bottom 0.305: v26.54,22.23 26.67,22.35 v26.67,30.86
N$49
  Top 0.305: X35.M2 40.77,57.15 40.81,57.1 44.82,57.1 R7.2
N$50
  Top 0.305: X35.M4 31.75,48.98 C13.2
N$51
  Top 0.305: L2.1 44.64,48.19 44.7,48.26 44.7,49.53 F1.2 44.32,51.44 44.32,54.99 43.56,55.75 31.75,55.75 30.99,54.99 30.99,54.1 29.97,53.09 29.97,50.29 28.83,49.15 28.45,49.15 27.43,48.13 D2.5
N$52  (via drill 0.5)
  Top 0.305: IC2.5 16.85,51.82 18.8,51.82 v19.3,51.31 | v13.97,54.36 R9.2
  Bottom 0.305: v19.3,51.31 19.18,51.44 19.18,53.59 18.41,54.36 v13.97,54.36
N$53
  Top 0.305: IC2.1 14.82,56.39 R8.2
N$54
  Top 0.305: JP1.1 21.21,34.92 22.1,34.92 | IC9.1 22.1,34.2 22.1,34.92 | R13.2 28.66,36.07 27.3,36.07 26.16,34.92 22.1,34.92
N$55
  Top 0.305: R10.1 LED4.A
RX
  Top 0.305: R8.1 10.16,56.39 9.91,56.13 9.91,50.8 13.84,46.86 13.84,45.09 15.62,43.31 15.62,36.2 16.45,35.37 | 16.45,35.37 16.51,35.31 19.56,35.31 21.72,33.15 IC9.2 | R12.1 16.41,35.37 16.45,35.37
TX  (via drill 0.5)
  Top 0.305: IC1.44 22.59,23.13 23.62,22.1 24.38,22.1 27.05,24.77 v27.81,24.77 | R9.1 10.92,54.32 10.92,50.93 14.73,47.12 14.73,46.23 16.64,44.32 v16.64,44.07
  Bottom 0.305: v27.81,24.77 27.81,32.13 23.24,36.7 | 23.24,36.7 JP4.1 | v16.64,44.07 16.76,44.2 20.7,44.2 20.95,43.94 20.95,38.35 22.61,36.7 23.24,36.7
VPORT  (via drill 0.5)
  Top 0.305: C2.1 15.06,52.44 IC2.4 20.71,52.44 v20.95,52.2 | IC2.17 v22.1,47.24
  Bottom 0.305: v20.95,52.2 20.95,47.62 21.34,47.24 v22.1,47.24
VSERVO
  Top 0.305: C7.+ 15.24,4.66 15.24,4.45 | C8.+ 38.48,4.66 38.48,4.45
  Top 2.184: 31.11,4.45 30.96,4.6
  Top 2.54: 31.11,4.45 38.48,4.45 53.98,4.45
  Top 2.921: X24.P$2 X23.P$2 X22.P$2 X21.P$2 X20.P$2 X11.P$2 X34.P$2 X3.P$2 X10.P$2 X9.P$2 X8.P$2 X7.P$2 X6.P$2 X5.P$2 X4.P$2 X1.P$2 5.71,6.35 7.62,4.45 15.24,4.45 30.99,4.45 | X25.P$2 X26.P$2 X27.P$2 X28.P$2 X29.P$2 X30.P$2 X31.P$2 X32.P$2 X12.P$2 X13.P$2 X14.P$2 X15.P$2 X16.P$2 X17.P$2 X18.P$2 X19.P$2 55.24,5.71 53.98,4.45 | 30.99,4.45 31.11,4.45 | 30.99,4.45 31.86,5.31 X2.2

### Text on the board
tPlace: Rev 1a | - | + | S | S | + | - | +5V | +5V | RX | TX | 1 | GND | +5V | SSX32